# Altium schematic sheet ESP-WROOM-32D.SchDoc
size A4; SheetNumber: 3; SheetTotal: 6
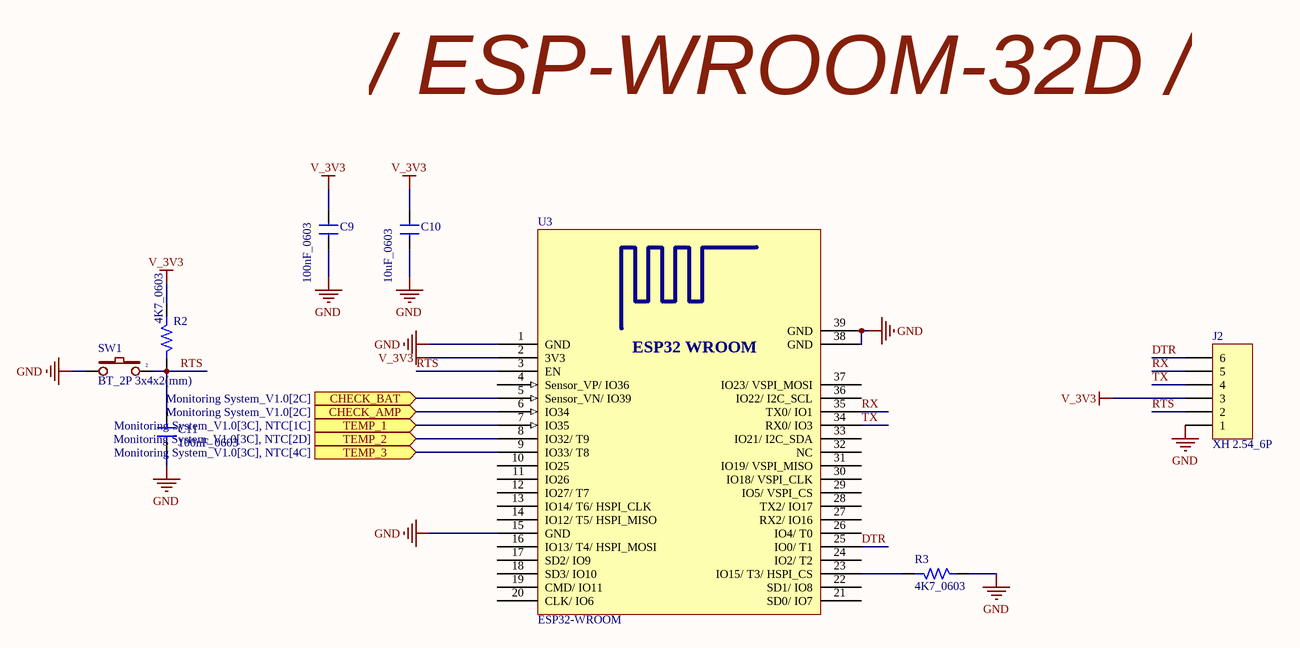
[diagram p0: ESP-WROOM-32D.SchDoc]

## Parts
C9  100nF_0603  [CN-SMD-0603]
C10  10uF_0603  [CN-SMD-0603]
C11  100nF_0603  [CN-SMD-0603]
J2  XH 2.54_6P  [JP6_Boot]
R2  4K7_0603  [RES-SMD-0603]
R3  4K7_0603  [RES-SMD-0603]
SW1  BT_2P 3x4x2(mm)  [BUTTON 2P 3X4X2MM]
U3  ESP32-WROOM  [ESP32 WROOM]

## Ports
CHECK_AMP (in, see Monitoring System_V1.0[2C]), CHECK_BAT (in, see Monitoring System_V1.0[2C]), TEMP_1 (in, see Monitoring System_V1.0[3C], NTC[1C]), TEMP_2 (in, see Monitoring System_V1.0[3C], NTC[2D]), TEMP_3 (in, see Monitoring System_V1.0[3C], NTC[4C])

## Nets
GND: C9.1 C10.1 C11.2 J2.1 R3.1 SW1.1 U3.1(GND) U3.15(GND) U3.38(GND) U3.39(GND)
V_3V3: C9.2 C10.2 J2.3 R2.2 U3.2(3V3)
CHECK_AMP: U3.6(IO34) ; port CHECK_AMP
CHECK_BAT: U3.5(Sensor_VN/_IO39) ; port CHECK_BAT
DTR: J2.6 U3.25(IO0/_T1)
RTS: C11.1 J2.2 R2.1 SW1.2 U3.3(EN)
RX: J2.5 U3.35(TX0/_IO1)
TEMP_1: U3.7(IO35) ; port TEMP_1
TEMP_2: U3.8(IO32/_T9) ; port TEMP_2
TEMP_3: U3.9(IO33/_T8) ; port TEMP_3
TX: J2.4 U3.34(RX0/_IO3)
NetR3_2: R3.2 U3.23(IO15/_T3/_HSPI_CS)

Not connected (* = marked no-connect by the designer): U3 4(Sensor_VP/_IO36) 10(IO25) 11(IO26) 12(IO27/_T7) 13(IO14/_T6/_HSPI_CLK) 14(IO12/_T5/_HSPI_MISO) 16(IO13/_T4/_HSPI_MOSI) 17(SD2/_IO9) 18(SD3/_IO10) 19(CMD/_IO11) 20(CLK/_IO6) 21(SD0/_IO7) 22(SD1/_IO8) 24(IO2/_T2) 26(IO4/_T0) 27(RX2/_IO16) 28(TX2/_IO17) 29(IO5/_VSPI_CS) 30(IO18/_VSPI_CLK) 31(IO19/_VSPI_MISO) 32(NC) 33(IO21/_I2C_SDA) 36(IO22/_I2C_SCL) 37(IO23/_VSPI_MOSI)

## Notes on the sheet
- / ESP-WROOM-32D /
- (in symbol ESP32-WROOM) ESP32 WROOM

## Library data of the parts
C9 C11 = CAP 0603 104: Cap SMD, 0.06x0.03 inch, 1.55x0.85 mm - 1608
C10 = CAP 0603 106: Cap SMD, 0.06x0.03 inch, 1.55x0.85 mm - 1608
J2 = XH 2.54_6P_Boot
R2 R3 = RES 0603 4K7: Resistor SMD, 0.06x0.03 inch, 1.55x0.85 mm - 1608, 1/10W
SW1 = BT_2P 3x4x2(mm): Switch button 2 pin; Value: SW chip 2 pin
U3 = ESP32-WROOM: ESP32 WROOM, 3.0 V ~ 3.6 V, 80mA.